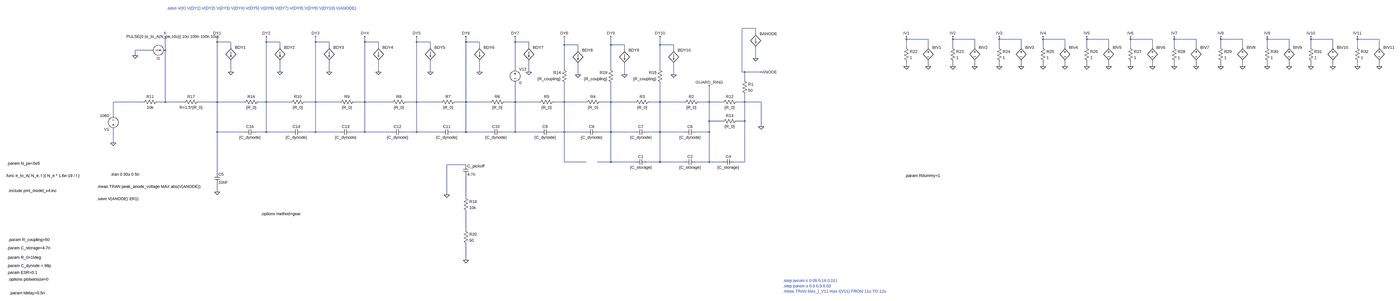
[diagram p0: schematic pmt_saturation_fit_v4.asc, whole sheet]
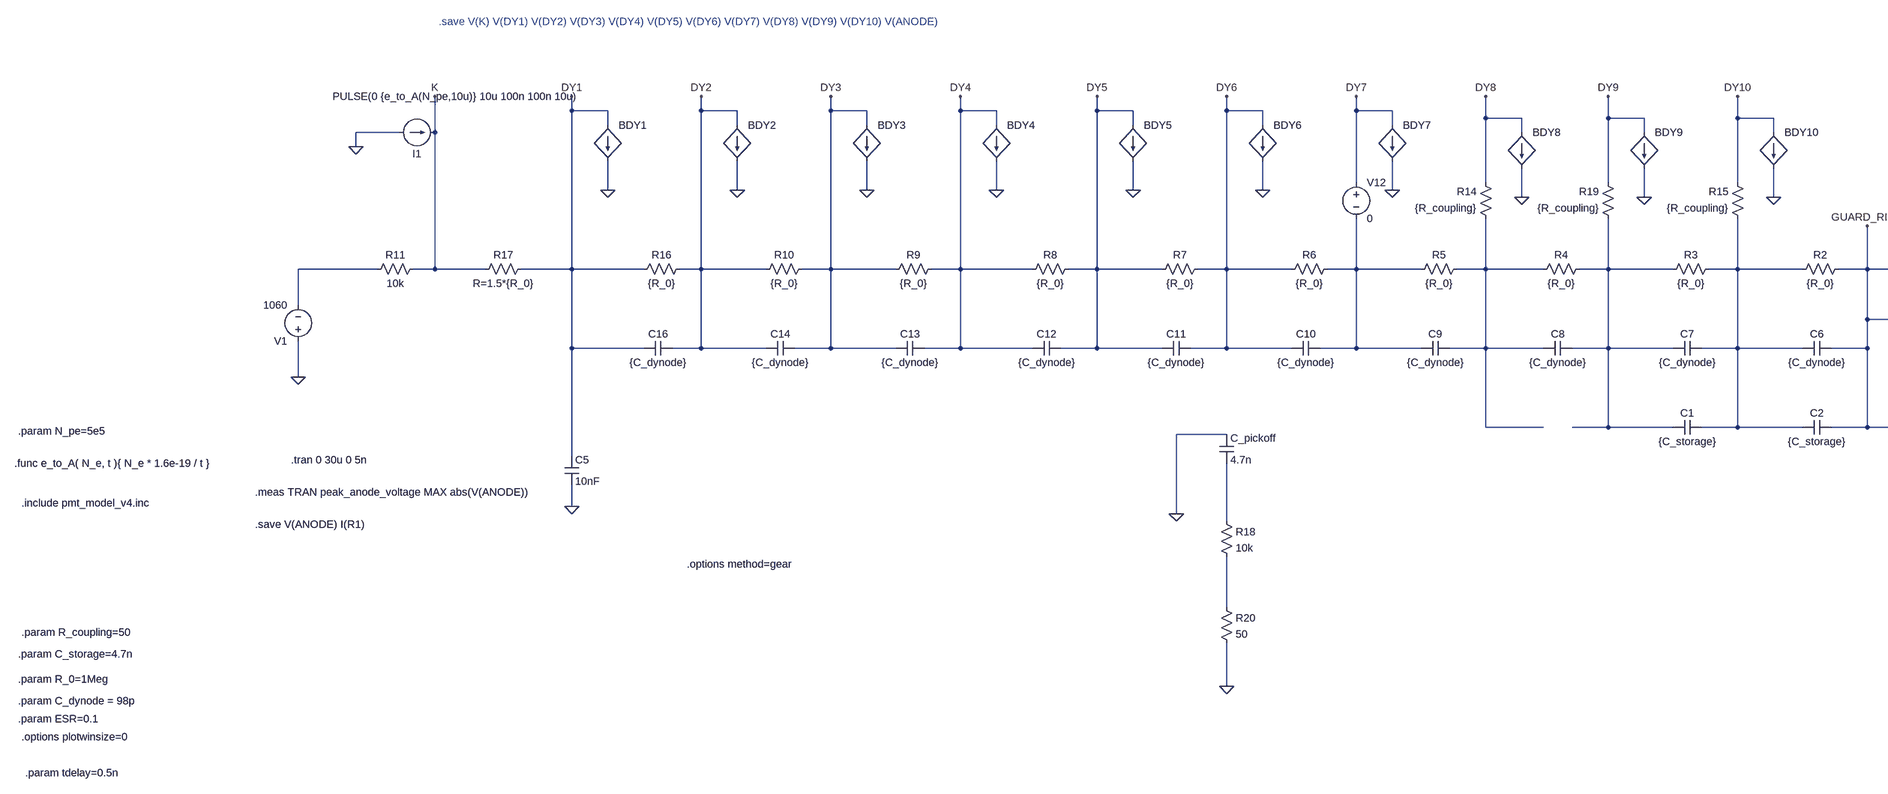
[diagram p1: schematic pmt_saturation_fit_v4.asc, part, row 1 of 1, column 1 of 2]
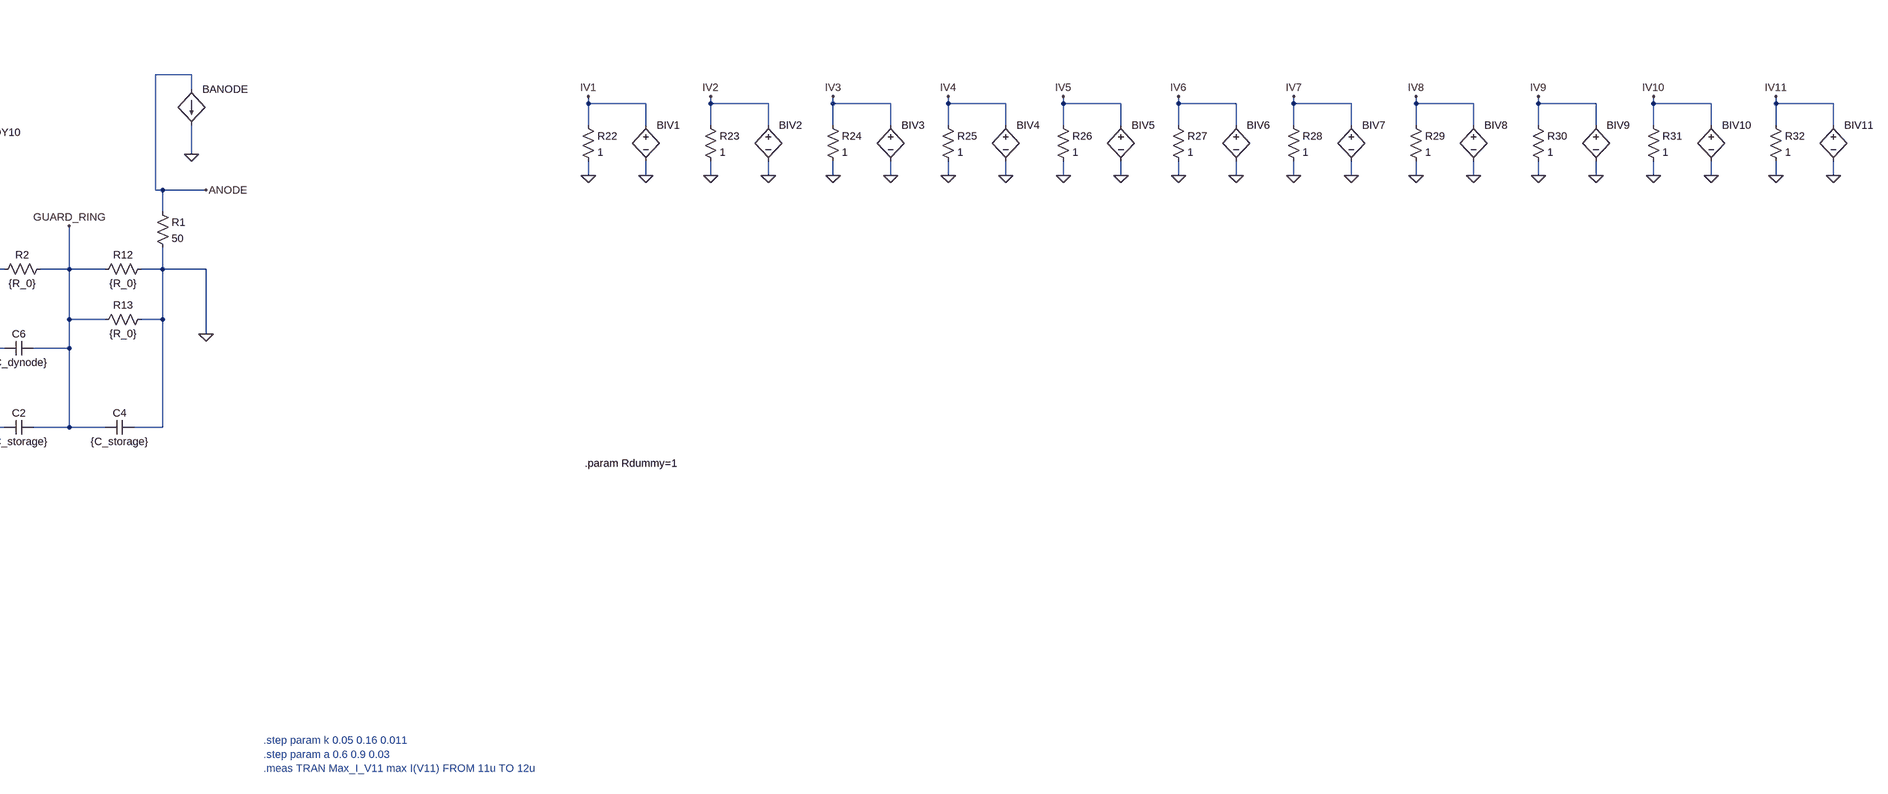
[diagram p2: schematic pmt_saturation_fit_v4.asc, part, row 1 of 1, column 2 of 2]
pmt_saturation_fit_v4.asc, the LTspice schematic file:
Version 4.1
SHEET 1 4788 1700
WIRE 928 -688 848 -688
WIRE 928 -656 928 -688
WIRE 1920 -624 1920 -640
WIRE 2048 -624 1920 -624
WIRE 2192 -624 2192 -640
WIRE 2320 -624 2192 -624
WIRE 2464 -624 2464 -640
WIRE 2592 -624 2464 -624
WIRE 2720 -624 2720 -640
WIRE 2848 -624 2720 -624
WIRE 2976 -624 2976 -640
WIRE 3104 -624 2976 -624
WIRE 3232 -624 3232 -640
WIRE 3360 -624 3232 -624
WIRE 3488 -624 3488 -640
WIRE 3616 -624 3488 -624
WIRE 3760 -624 3760 -640
WIRE 3888 -624 3760 -624
WIRE 4032 -624 4032 -640
WIRE 4160 -624 4032 -624
WIRE 4288 -624 4288 -640
WIRE 4416 -624 4288 -624
WIRE 4560 -624 4560 -640
WIRE 4688 -624 4560 -624
WIRE -2224 -608 -2224 -640
WIRE -2144 -608 -2224 -608
WIRE -1936 -608 -1936 -640
WIRE -1856 -608 -1936 -608
WIRE -1648 -608 -1648 -640
WIRE -1568 -608 -1648 -608
WIRE -1360 -608 -1360 -640
WIRE -1280 -608 -1360 -608
WIRE -1056 -608 -1056 -640
WIRE -976 -608 -1056 -608
WIRE -768 -608 -768 -640
WIRE -688 -608 -768 -608
WIRE -480 -608 -480 -640
WIRE -400 -608 -480 -608
WIRE -192 -592 -192 -640
WIRE -112 -592 -192 -592
WIRE 80 -592 80 -640
WIRE 160 -592 80 -592
WIRE 368 -592 368 -640
WIRE 448 -592 368 -592
WIRE -2144 -576 -2144 -608
WIRE -1856 -576 -1856 -608
WIRE -1568 -576 -1568 -608
WIRE -1280 -576 -1280 -608
WIRE -976 -576 -976 -608
WIRE -688 -576 -688 -608
WIRE -400 -576 -400 -608
WIRE 1920 -576 1920 -624
WIRE 2048 -576 2048 -624
WIRE 2192 -576 2192 -624
WIRE 2320 -576 2320 -624
WIRE 2464 -576 2464 -624
WIRE 2592 -576 2592 -624
WIRE 2720 -576 2720 -624
WIRE 2848 -576 2848 -624
WIRE 2976 -576 2976 -624
WIRE 3104 -576 3104 -624
WIRE 3232 -576 3232 -624
WIRE 3360 -576 3360 -624
WIRE 3488 -576 3488 -624
WIRE 3616 -576 3616 -624
WIRE 3760 -576 3760 -624
WIRE 3888 -576 3888 -624
WIRE 4032 -576 4032 -624
WIRE 4160 -576 4160 -624
WIRE 4288 -576 4288 -624
WIRE 4416 -576 4416 -624
WIRE 4560 -576 4560 -624
WIRE 4688 -576 4688 -624
WIRE -2608 -560 -2704 -560
WIRE -2528 -560 -2528 -640
WIRE -112 -560 -112 -592
WIRE 160 -560 160 -592
WIRE 448 -560 448 -592
WIRE -2704 -528 -2704 -560
WIRE 928 -512 928 -576
WIRE 1920 -464 1920 -496
WIRE 2048 -464 2048 -496
WIRE 2192 -464 2192 -496
WIRE 2320 -464 2320 -496
WIRE 2464 -464 2464 -496
WIRE 2592 -464 2592 -496
WIRE 2720 -464 2720 -496
WIRE 2848 -464 2848 -496
WIRE 2976 -464 2976 -496
WIRE 3104 -464 3104 -496
WIRE 3232 -464 3232 -496
WIRE 3360 -464 3360 -496
WIRE 3488 -464 3488 -496
WIRE 3616 -464 3616 -496
WIRE 3760 -464 3760 -496
WIRE 3888 -464 3888 -496
WIRE 4032 -464 4032 -496
WIRE 4160 -464 4160 -496
WIRE 4288 -464 4288 -496
WIRE 4416 -464 4416 -496
WIRE 4560 -464 4560 -496
WIRE 4688 -464 4688 -496
WIRE -480 -448 -480 -608
WIRE -192 -448 -192 -592
WIRE 80 -448 80 -592
WIRE 368 -448 368 -592
WIRE -2144 -432 -2144 -496
WIRE -1856 -432 -1856 -496
WIRE -1568 -432 -1568 -496
WIRE -1280 -432 -1280 -496
WIRE -976 -432 -976 -496
WIRE -688 -432 -688 -496
WIRE -400 -432 -400 -496
WIRE 848 -432 848 -688
WIRE 864 -432 848 -432
WIRE 960 -432 864 -432
WIRE -112 -416 -112 -480
WIRE 160 -416 160 -480
WIRE 448 -416 448 -480
WIRE 864 -384 864 -432
WIRE -2656 -256 -2832 -256
WIRE -2528 -256 -2528 -560
WIRE -2528 -256 -2576 -256
WIRE -2416 -256 -2528 -256
WIRE -2224 -256 -2224 -608
WIRE -2224 -256 -2336 -256
WIRE -2064 -256 -2224 -256
WIRE -1936 -256 -1936 -608
WIRE -1936 -256 -1984 -256
WIRE -1792 -256 -1936 -256
WIRE -1648 -256 -1648 -608
WIRE -1648 -256 -1712 -256
WIRE -1504 -256 -1648 -256
WIRE -1360 -256 -1360 -608
WIRE -1360 -256 -1424 -256
WIRE -1200 -256 -1360 -256
WIRE -1056 -256 -1056 -608
WIRE -1056 -256 -1120 -256
WIRE -912 -256 -1056 -256
WIRE -768 -256 -768 -608
WIRE -768 -256 -832 -256
WIRE -624 -256 -768 -256
WIRE -480 -256 -480 -368
WIRE -480 -256 -544 -256
WIRE -336 -256 -480 -256
WIRE -192 -256 -192 -368
WIRE -192 -256 -256 -256
WIRE -64 -256 -192 -256
WIRE 80 -256 80 -368
WIRE 80 -256 16 -256
WIRE 224 -256 80 -256
WIRE 368 -256 368 -368
WIRE 368 -256 304 -256
WIRE 512 -256 368 -256
WIRE 656 -256 656 -352
WIRE 656 -256 592 -256
WIRE 736 -256 656 -256
WIRE 864 -256 864 -304
WIRE 864 -256 816 -256
WIRE 960 -256 864 -256
WIRE -2832 -176 -2832 -256
WIRE 656 -144 656 -256
WIRE 736 -144 656 -144
WIRE 864 -144 864 -256
WIRE 864 -144 816 -144
WIRE 960 -112 960 -256
WIRE -2224 -80 -2224 -256
WIRE -2064 -80 -2224 -80
WIRE -1936 -80 -1936 -256
WIRE -1936 -80 -2000 -80
WIRE -1792 -80 -1936 -80
WIRE -1648 -80 -1648 -256
WIRE -1648 -80 -1728 -80
WIRE -1504 -80 -1648 -80
WIRE -1360 -80 -1360 -256
WIRE -1360 -80 -1440 -80
WIRE -1200 -80 -1360 -80
WIRE -1056 -80 -1056 -256
WIRE -1056 -80 -1136 -80
WIRE -912 -80 -1056 -80
WIRE -768 -80 -768 -256
WIRE -768 -80 -848 -80
WIRE -624 -80 -768 -80
WIRE -480 -80 -480 -256
WIRE -480 -80 -560 -80
WIRE -336 -80 -480 -80
WIRE -192 -80 -192 -256
WIRE -192 -80 -272 -80
WIRE -64 -80 -192 -80
WIRE 80 -80 80 -256
WIRE 80 -80 0 -80
WIRE 224 -80 80 -80
WIRE 368 -80 368 -256
WIRE 368 -80 288 -80
WIRE 512 -80 368 -80
WIRE 656 -80 656 -144
WIRE 656 -80 576 -80
WIRE -2832 -16 -2832 -96
WIRE -192 96 -192 -80
WIRE -64 96 -192 96
WIRE 80 96 80 -80
WIRE 80 96 0 96
WIRE 224 96 80 96
WIRE 368 96 368 -80
WIRE 368 96 288 96
WIRE 512 96 368 96
WIRE 656 96 656 -80
WIRE 656 96 576 96
WIRE 736 96 656 96
WIRE 864 96 864 -144
WIRE 864 96 800 96
WIRE -768 112 -880 112
WIRE -2224 160 -2224 -80
WIRE -2224 272 -2224 224
WIRE -880 288 -880 112
WIRE -768 304 -768 176
WIRE -768 496 -768 384
WIRE -768 672 -768 576
FLAG -2224 272 0
FLAG 960 -112 0
FLAG -2832 -16 0
FLAG -2224 -640 DY1
FLAG -1936 -640 DY2
FLAG -1648 -640 DY3
FLAG -1360 -640 DY4
FLAG -1056 -640 DY5
FLAG -768 -640 DY6
FLAG -480 -640 DY7
FLAG -192 -640 DY8
FLAG 80 -640 DY9
FLAG 368 -640 DY10
FLAG 656 -352 GUARD_RING
FLAG -2528 -640 K
FLAG 960 -432 ANODE
FLAG -768 672 0
FLAG -880 288 0
FLAG 1920 -464 0
FLAG 1920 -640 IV1
FLAG 2192 -464 0
FLAG 2192 -640 IV2
FLAG 2048 -464 0
FLAG 2320 -464 0
FLAG 2464 -464 0
FLAG 2464 -640 IV3
FLAG 2592 -464 0
FLAG 2720 -464 0
FLAG 2720 -640 IV4
FLAG 2848 -464 0
FLAG 2976 -464 0
FLAG 2976 -640 IV5
FLAG 3104 -464 0
FLAG 3232 -464 0
FLAG 3232 -640 IV6
FLAG 3360 -464 0
FLAG 3488 -464 0
FLAG 3488 -640 IV7
FLAG 3616 -464 0
FLAG 3760 -464 0
FLAG 3760 -640 IV8
FLAG 3888 -464 0
FLAG 4032 -464 0
FLAG 4032 -640 IV9
FLAG 4160 -464 0
FLAG 4288 -464 0
FLAG 4288 -640 IV10
FLAG 4416 -464 0
FLAG 4560 -464 0
FLAG 4560 -640 IV11
FLAG 4688 -464 0
FLAG -2144 -432 0
FLAG -1856 -432 0
FLAG -1568 -432 0
FLAG -1280 -432 0
FLAG -976 -432 0
FLAG -688 -432 0
FLAG -400 -432 0
FLAG -112 -416 0
FLAG 160 -416 0
FLAG 448 -416 0
FLAG 928 -512 0
FLAG -2704 -528 0
SYMBOL cap 288 80 R90
WINDOW 0 0 32 VBottom 2
WINDOW 3 32 32 VTop 2
SYMATTR InstName C1
SYMATTR Value {C_storage}
SYMATTR SpiceLine Rser={ESR}
SYMBOL cap 576 80 R90
WINDOW 0 0 32 VBottom 2
WINDOW 3 32 32 VTop 2
SYMATTR InstName C2
SYMATTR Value {C_storage}
SYMATTR SpiceLine Rser={ESR}
SYMBOL cap 800 80 R90
WINDOW 0 0 32 VBottom 2
WINDOW 3 32 32 VTop 2
SYMATTR InstName C4
SYMATTR Value {C_storage}
SYMATTR SpiceLine Rser={ESR}
SYMBOL cap -2240 160 R0
SYMATTR InstName C5
SYMATTR Value 10nF
SYMBOL cap 576 -96 R90
WINDOW 0 0 32 VBottom 2
WINDOW 3 32 32 VTop 2
SYMATTR InstName C6
SYMATTR Value {C_dynode}
SYMATTR SpiceLine Rser={ESR}
SYMBOL res 608 -272 R90
WINDOW 0 0 56 VBottom 2
WINDOW 3 32 56 VTop 2
SYMATTR InstName R2
SYMATTR Value {R_0}
SYMBOL cap 288 -96 R90
WINDOW 0 0 32 VBottom 2
WINDOW 3 32 32 VTop 2
SYMATTR InstName C7
SYMATTR Value {C_dynode}
SYMATTR SpiceLine Rser={ESR}
SYMBOL res 320 -272 R90
WINDOW 0 0 56 VBottom 2
WINDOW 3 32 56 VTop 2
SYMATTR InstName R3
SYMATTR Value {R_0}
SYMBOL cap 0 -96 R90
WINDOW 0 0 32 VBottom 2
WINDOW 3 32 32 VTop 2
SYMATTR InstName C8
SYMATTR Value {C_dynode}
SYMATTR SpiceLine Rser={ESR}
SYMBOL res 32 -272 R90
WINDOW 0 0 56 VBottom 2
WINDOW 3 32 56 VTop 2
SYMATTR InstName R4
SYMATTR Value {R_0}
SYMBOL cap -272 -96 R90
WINDOW 0 0 32 VBottom 2
WINDOW 3 32 32 VTop 2
SYMATTR InstName C9
SYMATTR Value {C_dynode}
SYMATTR SpiceLine Rser={ESR}
SYMBOL res -240 -272 R90
WINDOW 0 0 56 VBottom 2
WINDOW 3 32 56 VTop 2
SYMATTR InstName R5
SYMATTR Value {R_0}
SYMBOL cap -560 -96 R90
WINDOW 0 0 32 VBottom 2
WINDOW 3 32 32 VTop 2
SYMATTR InstName C10
SYMATTR Value {C_dynode}
SYMATTR SpiceLine Rser={ESR}
SYMBOL res -528 -272 R90
WINDOW 0 0 56 VBottom 2
WINDOW 3 32 56 VTop 2
SYMATTR InstName R6
SYMATTR Value {R_0}
SYMBOL cap -848 -96 R90
WINDOW 0 0 32 VBottom 2
WINDOW 3 32 32 VTop 2
SYMATTR InstName C11
SYMATTR Value {C_dynode}
SYMATTR SpiceLine Rser={ESR}
SYMBOL res -816 -272 R90
WINDOW 0 0 56 VBottom 2
WINDOW 3 32 56 VTop 2
SYMATTR InstName R7
SYMATTR Value {R_0}
SYMBOL cap -1136 -96 R90
WINDOW 0 0 32 VBottom 2
WINDOW 3 32 32 VTop 2
SYMATTR InstName C12
SYMATTR Value {C_dynode}
SYMATTR SpiceLine Rser={ESR}
SYMBOL res -1104 -272 R90
WINDOW 0 0 56 VBottom 2
WINDOW 3 32 56 VTop 2
SYMATTR InstName R8
SYMATTR Value {R_0}
SYMBOL cap -1440 -96 R90
WINDOW 0 0 32 VBottom 2
WINDOW 3 32 32 VTop 2
SYMATTR InstName C13
SYMATTR Value {C_dynode}
SYMATTR SpiceLine Rser={ESR}
SYMBOL res -1408 -272 R90
WINDOW 0 0 56 VBottom 2
WINDOW 3 32 56 VTop 2
SYMATTR InstName R9
SYMATTR Value {R_0}
SYMBOL cap -1728 -96 R90
WINDOW 0 0 32 VBottom 2
WINDOW 3 32 32 VTop 2
SYMATTR InstName C14
SYMATTR Value {C_dynode}
SYMATTR SpiceLine Rser={ESR}
SYMBOL res -1696 -272 R90
WINDOW 0 0 56 VBottom 2
WINDOW 3 32 56 VTop 2
SYMATTR InstName R10
SYMATTR Value {R_0}
SYMBOL res -2560 -272 R90
WINDOW 0 0 56 VBottom 2
WINDOW 3 32 56 VTop 2
SYMATTR InstName R11
SYMATTR Value 10k
SYMBOL res 832 -272 R90
WINDOW 0 0 56 VBottom 2
WINDOW 3 32 56 VTop 2
SYMATTR InstName R12
SYMATTR Value {R_0}
SYMBOL res 832 -160 R90
WINDOW 0 0 56 VBottom 2
WINDOW 3 32 56 VTop 2
SYMATTR InstName R13
SYMATTR Value {R_0}
SYMBOL res 384 -352 R180
WINDOW 0 36 76 Left 2
WINDOW 3 36 40 Left 2
SYMATTR InstName R15
SYMATTR Value {R_coupling}
SYMBOL cap -2000 -96 R90
WINDOW 0 0 32 VBottom 2
WINDOW 3 32 32 VTop 2
SYMATTR InstName C16
SYMATTR Value {C_dynode}
SYMATTR SpiceLine Rser={ESR}
SYMBOL res -1968 -272 R90
WINDOW 0 0 56 VBottom 2
WINDOW 3 32 56 VTop 2
SYMATTR InstName R16
SYMATTR Value {R_0}
SYMBOL current -2608 -560 R270
WINDOW 0 -32 40 VBottom 2
WINDOW 3 64 125 VTop 2
WINDOW 123 0 0 Left 0
WINDOW 39 0 0 Left 0
SYMATTR InstName I1
SYMATTR Value PULSE(0 {e_to_A(N_pe,10u)} 10u 100n 100n 10u)
SYMBOL res -2320 -272 R90
WINDOW 0 0 56 VBottom 2
WINDOW 3 32 56 VTop 2
SYMATTR InstName R17
SYMATTR Value R=1.5*{R_0}
SYMBOL voltage -2832 -80 R180
WINDOW 123 0 0 Left 0
WINDOW 39 0 0 Left 0
SYMATTR InstName V1
SYMATTR Value 1060
SYMBOL cap -784 112 R0
SYMATTR InstName C_pickoff
SYMATTR Value 4.7n
SYMATTR SpiceLine Rser={ESR}
SYMBOL res -784 288 R0
SYMATTR InstName R18
SYMATTR Value 10k
SYMBOL res 848 -400 R0
SYMATTR InstName R1
SYMATTR Value 50
SYMBOL res -176 -352 R180
WINDOW 0 36 76 Left 2
WINDOW 3 36 40 Left 2
SYMATTR InstName R14
SYMATTR Value {R_coupling}
SYMBOL res 96 -352 R180
WINDOW 0 36 76 Left 2
WINDOW 3 36 40 Left 2
SYMATTR InstName R19
SYMATTR Value {R_coupling}
SYMBOL voltage -480 -464 R0
WINDOW 123 0 0 Left 0
WINDOW 39 0 0 Left 0
SYMATTR InstName V12
SYMATTR Value 0
SYMBOL res -784 480 R0
SYMATTR InstName R20
SYMATTR Value 50
SYMBOL res 1904 -592 R0
SYMATTR InstName R22
SYMATTR Value 1
SYMBOL res 2176 -592 R0
SYMATTR InstName R23
SYMATTR Value 1
SYMBOL bv 2048 -592 R0
WINDOW 3 24 96 Invisible 2
SYMATTR Value V=-delay(I(I1),tdelay)
SYMATTR InstName BIV1
SYMBOL bv 2320 -592 R0
WINDOW 3 24 96 Invisible 2
SYMATTR Value V = delay(V(IV1),tdelay) * g_effective( V(DY1,K), V(DY2,DY1), V(IV1), Vknee, IscDefault )
SYMATTR InstName BIV2
SYMBOL res 2448 -592 R0
SYMATTR InstName R24
SYMATTR Value 1
SYMBOL bv 2592 -592 R0
WINDOW 3 24 96 Invisible 2
SYMATTR Value V = delay(V(IV2),tdelay) * g_effective( V(DY2,DY1), V(DY3,DY2), V(IV2), Vknee, IscDefault )
SYMATTR InstName BIV3
SYMBOL res 2704 -592 R0
SYMATTR InstName R25
SYMATTR Value 1
SYMBOL bv 2848 -592 R0
WINDOW 3 24 96 Invisible 2
SYMATTR Value V = delay(V(IV3),tdelay) * g_effective( V(DY3,DY2), V(DY4,DY3), V(IV3), Vknee, IscDefault )
SYMATTR InstName BIV4
SYMBOL res 2960 -592 R0
SYMATTR InstName R26
SYMATTR Value 1
SYMBOL bv 3104 -592 R0
WINDOW 3 24 96 Invisible 2
SYMATTR Value V = delay(V(IV4),tdelay) * g_effective( V(DY4,DY3), V(DY5,DY4), V(IV4), Vknee, IscDefault )
SYMATTR InstName BIV5
SYMBOL res 3216 -592 R0
SYMATTR InstName R27
SYMATTR Value 1
SYMBOL bv 3360 -592 R0
WINDOW 3 24 96 Invisible 2
SYMATTR Value V = delay(V(IV5),tdelay) * g_effective( V(DY5,DY4), V(DY6,DY5), V(IV5), Vknee, IscDefault )
SYMATTR InstName BIV6
SYMBOL res 3472 -592 R0
SYMATTR InstName R28
SYMATTR Value 1
SYMBOL bv 3616 -592 R0
WINDOW 3 24 96 Invisible 2
SYMATTR Value V = delay(V(IV6),tdelay) * g_effective( V(DY6,DY5),  V(DY7,DY6),   V(IV6),  Vknee, IscDefault )
SYMATTR InstName BIV7
SYMBOL res 3744 -592 R0
SYMATTR InstName R29
SYMATTR Value 1
SYMBOL bv 3888 -592 R0
WINDOW 3 24 96 Invisible 2
SYMATTR Value V = delay(V(IV7),tdelay) * g_effective( V(DY7,DY6),  V(DY8,DY7),   V(IV7),  Vknee, IscDefault )
SYMATTR InstName BIV8
SYMBOL res 4016 -592 R0
SYMATTR InstName R30
SYMATTR Value 1
SYMBOL bv 4160 -592 R0
WINDOW 3 24 96 Invisible 2
SYMATTR Value V = delay(V(IV8),tdelay) * g_effective( V(DY8,DY7),  V(DY9,DY8),   V(IV8),  Vknee, Isc8 )
SYMATTR InstName BIV9
SYMBOL res 4272 -592 R0
SYMATTR InstName R31
SYMATTR Value 1
SYMBOL bv 4416 -592 R0
WINDOW 3 24 96 Invisible 2
SYMATTR Value V = delay(V(IV9),tdelay) * g_effective( V(DY9,DY8),  V(DY10,DY9),  V(IV9),  Vknee, Isc9 )
SYMATTR InstName BIV10
SYMBOL res 4544 -592 R0
SYMATTR InstName R32
SYMATTR Value 1
SYMBOL bv 4688 -592 R0
WINDOW 3 24 96 Invisible 2
SYMATTR Value V = delay(V(IV10),tdelay)* g_effective( V(DY10,DY9), V(ANODE,DY10),V(IV10), Vknee, Isc10 )
SYMATTR InstName BIV11
SYMBOL bi -2144 -576 R0
WINDOW 3 24 80 Invisible 2
SYMATTR Value I=V(IV2)-V(IV1)
SYMATTR InstName BDY1
SYMBOL bi -1856 -576 R0
WINDOW 3 24 80 Invisible 2
SYMATTR Value I=V(IV3)-V(IV2)
SYMATTR InstName BDY2
SYMBOL bi -1568 -576 R0
WINDOW 3 24 80 Invisible 2
SYMATTR Value I=V(IV4)-V(IV3)
SYMATTR InstName BDY3
SYMBOL bi -1280 -576 R0
WINDOW 3 24 80 Invisible 2
SYMATTR Value I=V(IV5)-V(IV4)
SYMATTR InstName BDY4
SYMBOL bi -976 -576 R0
WINDOW 3 24 80 Invisible 2
SYMATTR Value I=V(IV6)-V(IV5)
SYMATTR InstName BDY5
SYMBOL bi -688 -576 R0
WINDOW 3 24 80 Invisible 2
SYMATTR Value I=V(IV7)-V(IV6)
SYMATTR InstName BDY6
SYMBOL bi -400 -576 R0
WINDOW 3 24 80 Invisible 2
SYMATTR Value I=V(IV8)-V(IV7)
SYMATTR InstName BDY7
SYMBOL bi -112 -560 R0
WINDOW 3 24 80 Invisible 2
SYMATTR Value I=V(IV9)-V(IV8)
SYMATTR InstName BDY8
SYMBOL bi 160 -560 R0
WINDOW 3 24 80 Invisible 2
SYMATTR Value I=V(IV10)-V(IV9)
SYMATTR InstName BDY9
SYMBOL bi 448 -560 R0
WINDOW 3 24 80 Invisible 2
SYMATTR Value I=V(IV11)-V(IV10)
SYMATTR InstName BDY10
SYMBOL bi 928 -656 R0
WINDOW 3 24 80 Invisible 2
SYMATTR Value I=-V(IV11)
SYMATTR InstName BANODE
TEXT -2848 168 Left 2 !.tran 0 30u 0 5n
TEXT -3600 600 Left 2 !.param C_storage=4.7n
TEXT -3600 656 Left 2 !.param R_0=1Meg
TEXT -3600 704 Left 2 !.param C_dynode = 98p
TEXT -3608 176 Left 2 !.func e_to_A( N_e, t ){ N_e * 1.6e-19 / t }
TEXT -3600 104 Left 2 !.param N_pe=5e5
TEXT 1088 792 Left 2 ;.step param k 0.05 0.16 0.011\n.step param a 0.6 0.9 0.03\n.meas TRAN Max_I_V11 max I(V11) FROM 11u TO 12u
TEXT -3592 784 Left 2 !.options plotwinsize=0
TEXT -1968 400 Left 2 !.options method=gear
TEXT -3600 744 Left 2 !.param ESR=0.1
TEXT -3584 864 Left 2 !.param tdelay=0.5n
TEXT -3592 264 Left 2 !.include pmt_model_v4.inc
TEXT -3592 552 Left 2 !.param R_coupling=50
TEXT 1912 176 Left 2 !.param Rdummy=1
TEXT -2520 -1072 Left 2 ;.save V(K) V(DY1) V(DY2) V(DY3) V(DY4) V(DY5) V(DY6) V(DY7) V(DY8) V(DY9) V(DY10) V(ANODE)
TEXT -2928 240 Left 2 !.meas TRAN peak_anode_voltage MAX abs(V(ANODE))
TEXT -2928 312 Left 2 !.save V(ANODE) I(R1)

The netlist it stands for:
* pmt_saturation_fit_v4.asc
C1 N005 N004 {C_storage} Rser={ESR}
C2 GUARD_RING N005 {C_storage} Rser={ESR}
C4 0 GUARD_RING {C_storage} Rser={ESR}
C5 DY1 0 10nF
C6 GUARD_RING N005 {C_dynode} Rser={ESR}
R2 GUARD_RING N005 {R_0}
C7 N005 N004 {C_dynode} Rser={ESR}
R3 N005 N004 {R_0}
C8 N004 N003 {C_dynode} Rser={ESR}
R4 N004 N003 {R_0}
C9 N003 N002 {C_dynode} Rser={ESR}
R5 N003 N002 {R_0}
C10 N002 DY6 {C_dynode} Rser={ESR}
R6 N002 DY6 {R_0}
C11 DY6 DY5 {C_dynode} Rser={ESR}
R7 DY6 DY5 {R_0}
C12 DY5 DY4 {C_dynode} Rser={ESR}
R8 DY5 DY4 {R_0}
C13 DY4 DY3 {C_dynode} Rser={ESR}
R9 DY4 DY3 {R_0}
C14 DY3 DY2 {C_dynode} Rser={ESR}
R10 DY3 DY2 {R_0}
R11 K N001 10k
R12 0 GUARD_RING {R_0}
R13 0 GUARD_RING {R_0}
R15 N005 DY10 {R_coupling}
C16 DY2 DY1 {C_dynode} Rser={ESR}
R16 DY2 DY1 {R_0}
I1 0 K PULSE(0 {e_to_A(N_pe,10u)} 10u 100n 100n 10u)
R17 DY1 K R=1.5*{R_0}
V1 0 N001 1060
C_pickoff 0 N006 4.7n Rser={ESR}
R18 N006 N007 10k
R1 ANODE 0 50
R14 N003 DY8 {R_coupling}
R19 N004 DY9 {R_coupling}
V12 DY7 N002 0
R20 N007 0 50
R22 IV1 0 1
R23 IV2 0 1
BIV1 IV1 0 V=-delay(I(I1),tdelay)
BIV2 IV2 0 V = delay(V(IV1),tdelay) * g_effective( V(DY1,K), V(DY2,DY1), V(IV1), Vknee, IscDefault )
R24 IV3 0 1
BIV3 IV3 0 V = delay(V(IV2),tdelay) * g_effective( V(DY2,DY1), V(DY3,DY2), V(IV2), Vknee, IscDefault )
R25 IV4 0 1
BIV4 IV4 0 V = delay(V(IV3),tdelay) * g_effective( V(DY3,DY2), V(DY4,DY3), V(IV3), Vknee, IscDefault )
R26 IV5 0 1
BIV5 IV5 0 V = delay(V(IV4),tdelay) * g_effective( V(DY4,DY3), V(DY5,DY4), V(IV4), Vknee, IscDefault )
R27 IV6 0 1
BIV6 IV6 0 V = delay(V(IV5),tdelay) * g_effective( V(DY5,DY4), V(DY6,DY5), V(IV5), Vknee, IscDefault )
R28 IV7 0 1
BIV7 IV7 0 V = delay(V(IV6),tdelay) * g_effective( V(DY6,DY5),  V(DY7,DY6),   V(IV6),  Vknee, IscDefault )
R29 IV8 0 1
BIV8 IV8 0 V = delay(V(IV7),tdelay) * g_effective( V(DY7,DY6),  V(DY8,DY7),   V(IV7),  Vknee, IscDefault )
R30 IV9 0 1
BIV9 IV9 0 V = delay(V(IV8),tdelay) * g_effective( V(DY8,DY7),  V(DY9,DY8),   V(IV8),  Vknee, Isc8 )
R31 IV10 0 1
BIV10 IV10 0 V = delay(V(IV9),tdelay) * g_effective( V(DY9,DY8),  V(DY10,DY9),  V(IV9),  Vknee, Isc9 )
R32 IV11 0 1
BIV11 IV11 0 V = delay(V(IV10),tdelay)* g_effective( V(DY10,DY9), V(ANODE,DY10),V(IV10), Vknee, Isc10 )
BDY1 DY1 0 I=V(IV2)-V(IV1)
BDY2 DY2 0 I=V(IV3)-V(IV2)
BDY3 DY3 0 I=V(IV4)-V(IV3)
BDY4 DY4 0 I=V(IV5)-V(IV4)
BDY5 DY5 0 I=V(IV6)-V(IV5)
BDY6 DY6 0 I=V(IV7)-V(IV6)
BDY7 DY7 0 I=V(IV8)-V(IV7)
BDY8 DY8 0 I=V(IV9)-V(IV8)
BDY9 DY9 0 I=V(IV10)-V(IV9)
BDY10 DY10 0 I=V(IV11)-V(IV10)
BANODE ANODE 0 I=-V(IV11)
.tran 0 30u 0 5n
.param C_storage=4.7n
.param R_0=1Meg
.param C_dynode = 98p
.func e_to_A( N_e, t ){ N_e * 1.6e-19 / t }
.param N_pe=5e5
* .step param k 0.05 0.16 0.011
* .step param a 0.6 0.9 0.03
* .meas TRAN Max_I_V11 max I(V11) FROM 11u TO 12u
.options plotwinsize=0
.options method=gear
.param ESR=0.1
.param tdelay=0.5n
.include pmt_model_v4.inc
.param R_coupling=50
.param Rdummy=1
* .save V(K) V(DY1) V(DY2) V(DY3) V(DY4) V(DY5) V(DY6) V(DY7) V(DY8) V(DY9) V(DY10) V(ANODE)
.meas TRAN peak_anode_voltage MAX abs(V(ANODE))
.save V(ANODE) I(R1)
.backanno
.end